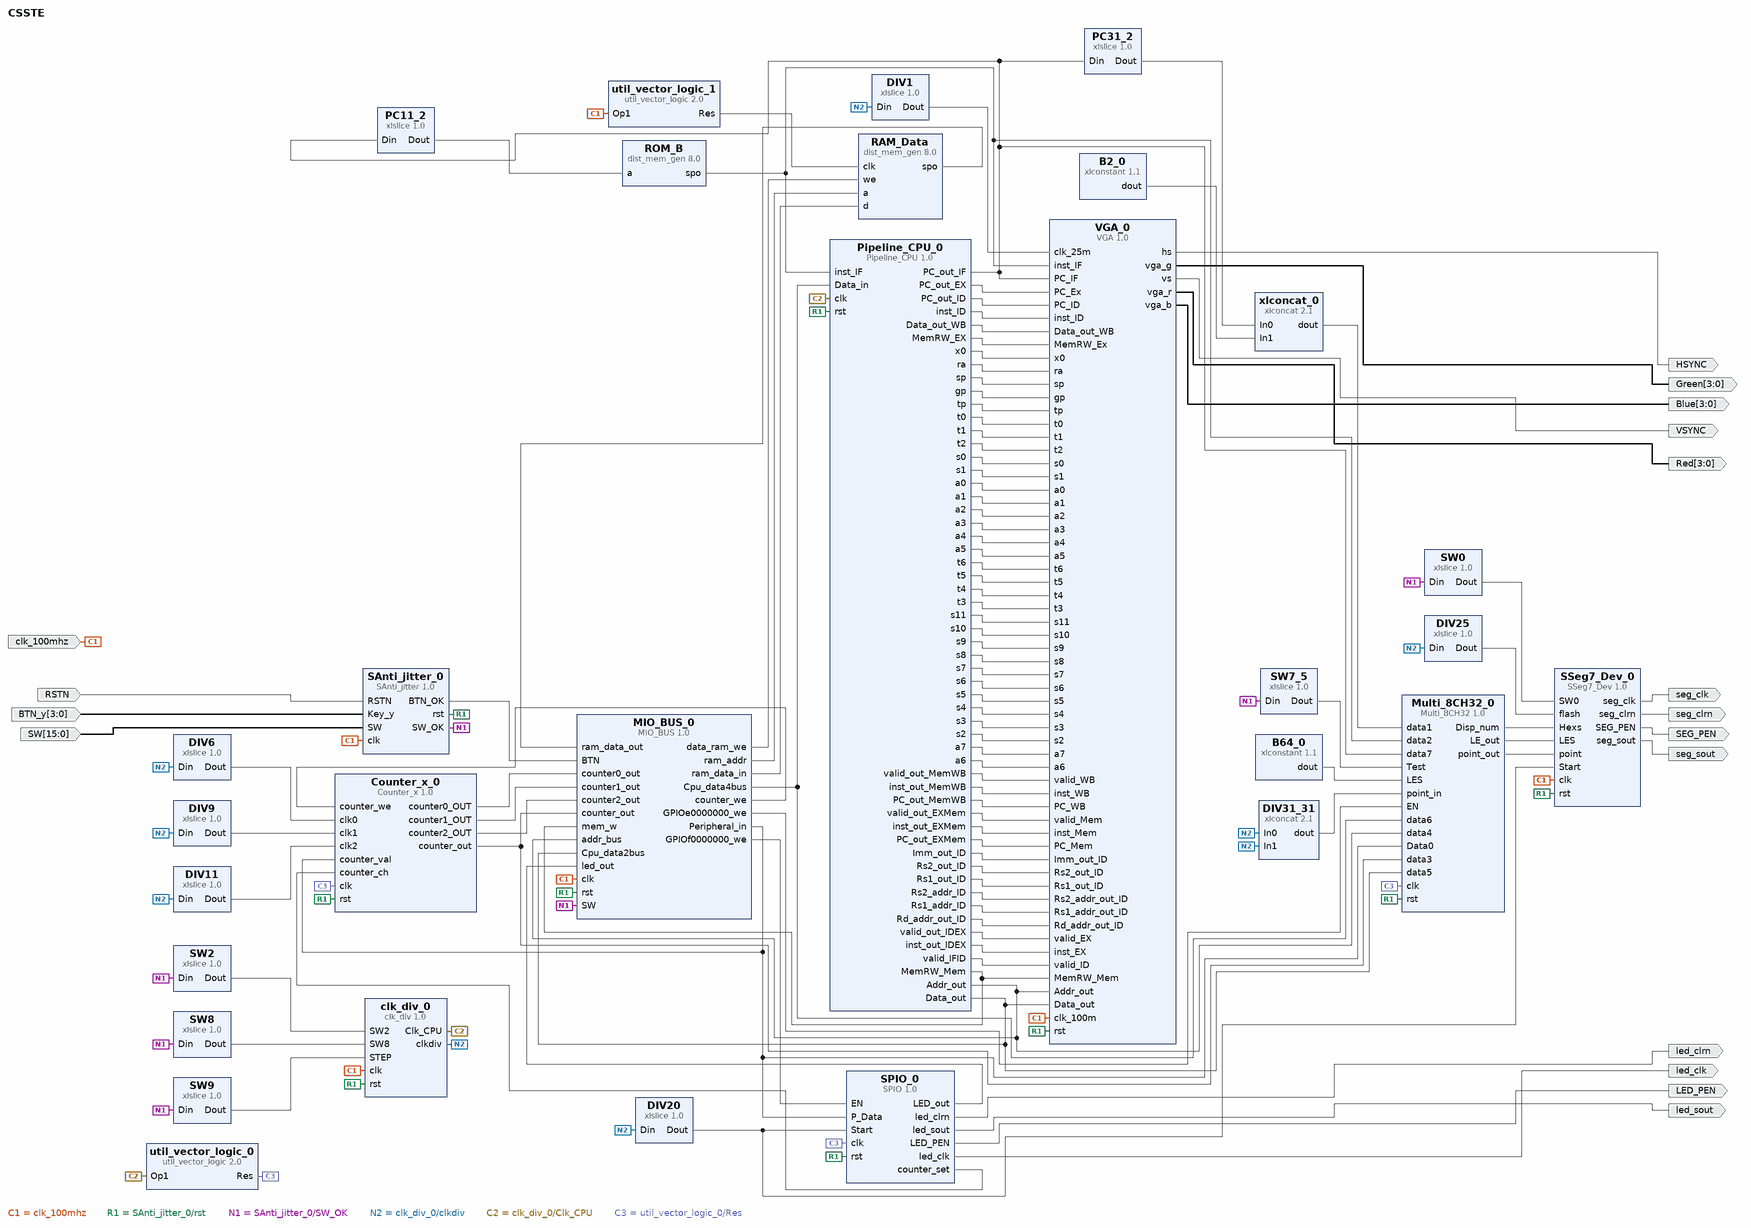
[diagram p0: block diagram of the top level]
# Vivado block design CSSTE, xc7k160tffg676-2L, Vivado 2020.2
create_bd_design CSSTE

create_bd_port -dir I -type rst RSTN
set_property -dict {CONFIG.POLARITY ACTIVE_HIGH} [get_bd_ports RSTN]
create_bd_port -dir I -type clk clk_100mhz
create_bd_port -dir I -from 3 -to 0 BTN_y
create_bd_port -dir I -from 15 -to 0 SW
create_bd_port -dir O -type clk seg_clk
create_bd_port -dir O seg_clrn
create_bd_port -dir O SEG_PEN
create_bd_port -dir O seg_sout
create_bd_port -dir O HSYNC
create_bd_port -dir O VSYNC
create_bd_port -dir O -from 3 -to 0 Green
create_bd_port -dir O -from 3 -to 0 Red
create_bd_port -dir O -from 3 -to 0 Blue
create_bd_port -dir O led_clrn
create_bd_port -dir O led_sout
create_bd_port -dir O LED_PEN
create_bd_port -dir O -type clk led_clk

create_bd_cell -type ip -vlnv xilinx.com:user:SAnti_jitter:1.0 SAnti_jitter_0
create_bd_cell -type ip -vlnv xilinx.com:user:clk_div:1.0 clk_div_0
create_bd_cell -type ip -vlnv xilinx.com:user:MIO_BUS:1.0 MIO_BUS_0
create_bd_cell -type ip -vlnv xilinx.com:user:Multi_8CH32:1.0 Multi_8CH32_0
create_bd_cell -type ip -vlnv xilinx.com:user:Counter_x:1.0 Counter_x_0
create_bd_cell -type ip -vlnv xilinx.com:user:SPIO:1.0 SPIO_0
create_bd_cell -type ip -vlnv xilinx.com:user:SSeg7_Dev:1.0 SSeg7_Dev_0
create_bd_cell -type ip -vlnv xilinx.com:ip:dist_mem_gen:8.0 ROM_B
set_property -dict [list \
  CONFIG.coefficient_file ../../../../../../COE_hazard/I_mem.coe \
  CONFIG.data_width 32 \
  CONFIG.depth 1024 \
  CONFIG.memory_type rom \
] [get_bd_cells ROM_B]
create_bd_cell -type ip -vlnv xilinx.com:ip:util_vector_logic:2.0 util_vector_logic_0
set_property -dict {CONFIG.C_OPERATION not CONFIG.C_SIZE 1} [get_bd_cells util_vector_logic_0]
create_bd_cell -type ip -vlnv xilinx.com:ip:util_vector_logic:2.0 util_vector_logic_1
set_property -dict {CONFIG.C_OPERATION not CONFIG.C_SIZE 1} [get_bd_cells util_vector_logic_1]
create_bd_cell -type ip -vlnv xilinx.com:ip:xlconcat:2.1 xlconcat_0
set_property -dict {CONFIG.IN0_WIDTH 30 CONFIG.IN1_WIDTH 2 CONFIG.dout_width 32} [get_bd_cells xlconcat_0]
create_bd_cell -type ip -vlnv xilinx.com:ip:xlconcat:2.1 DIV31_31
set_property -dict {CONFIG.IN0_WIDTH 32 CONFIG.IN1_WIDTH 32 CONFIG.dout_width 64} [get_bd_cells DIV31_31]
create_bd_cell -type ip -vlnv xilinx.com:ip:xlconstant:1.1 B64_0
set_property -dict {CONFIG.CONST_VAL 0 CONFIG.CONST_WIDTH 64} [get_bd_cells B64_0]
create_bd_cell -type ip -vlnv xilinx.com:ip:xlconstant:1.1 B2_0
set_property -dict {CONFIG.CONST_VAL 0 CONFIG.CONST_WIDTH 2} [get_bd_cells B2_0]
create_bd_cell -type ip -vlnv xilinx.com:ip:xlslice:1.0 SW7_5
set_property -dict {CONFIG.DIN_FROM 7 CONFIG.DIN_TO 5 CONFIG.DIN_WIDTH 16 CONFIG.DOUT_WIDTH 3} [get_bd_cells SW7_5]
create_bd_cell -type ip -vlnv xilinx.com:ip:xlslice:1.0 SW8
set_property -dict {CONFIG.DIN_FROM 8 CONFIG.DIN_TO 8 CONFIG.DIN_WIDTH 16 CONFIG.DOUT_WIDTH 1} [get_bd_cells SW8]
create_bd_cell -type ip -vlnv xilinx.com:ip:xlslice:1.0 DIV1
set_property -dict {CONFIG.DIN_FROM 1 CONFIG.DIN_TO 1} [get_bd_cells DIV1]
create_bd_cell -type ip -vlnv xilinx.com:ip:xlslice:1.0 PC11_2
set_property -dict {CONFIG.DIN_FROM 11 CONFIG.DIN_TO 2 CONFIG.DOUT_WIDTH 10} [get_bd_cells PC11_2]
create_bd_cell -type ip -vlnv xilinx.com:ip:xlslice:1.0 PC31_2
set_property -dict {CONFIG.DIN_FROM 31 CONFIG.DIN_TO 2 CONFIG.DOUT_WIDTH 30} [get_bd_cells PC31_2]
create_bd_cell -type ip -vlnv xilinx.com:ip:xlslice:1.0 SW2
set_property -dict {CONFIG.DIN_FROM 2 CONFIG.DIN_TO 2 CONFIG.DIN_WIDTH 16 CONFIG.DOUT_WIDTH 1} [get_bd_cells SW2]
create_bd_cell -type ip -vlnv xilinx.com:ip:xlslice:1.0 SW0
set_property -dict {CONFIG.DIN_FROM 0 CONFIG.DIN_TO 0 CONFIG.DIN_WIDTH 16} [get_bd_cells SW0]
create_bd_cell -type ip -vlnv xilinx.com:ip:xlslice:1.0 DIV6
set_property -dict {CONFIG.DIN_FROM 6 CONFIG.DIN_TO 6 CONFIG.DOUT_WIDTH 1} [get_bd_cells DIV6]
create_bd_cell -type ip -vlnv xilinx.com:ip:xlslice:1.0 DIV20
set_property -dict {CONFIG.DIN_FROM 20 CONFIG.DIN_TO 20 CONFIG.DOUT_WIDTH 1} [get_bd_cells DIV20]
create_bd_cell -type ip -vlnv xilinx.com:ip:xlslice:1.0 DIV11
set_property -dict {CONFIG.DIN_FROM 11 CONFIG.DIN_TO 11 CONFIG.DOUT_WIDTH 1} [get_bd_cells DIV11]
create_bd_cell -type ip -vlnv xilinx.com:ip:xlslice:1.0 DIV9
set_property -dict {CONFIG.DIN_FROM 9 CONFIG.DIN_TO 9 CONFIG.DOUT_WIDTH 1} [get_bd_cells DIV9]
create_bd_cell -type ip -vlnv xilinx.com:ip:xlslice:1.0 DIV25
set_property -dict {CONFIG.DIN_FROM 25 CONFIG.DIN_TO 25 CONFIG.DOUT_WIDTH 1} [get_bd_cells DIV25]
create_bd_cell -type ip -vlnv xilinx.com:ip:dist_mem_gen:8.0 RAM_Data
set_property -dict [list \
  CONFIG.coefficient_file ../../../../../../COE/D_mem.coe \
  CONFIG.data_width 32 \
  CONFIG.depth 1024 \
] [get_bd_cells RAM_Data]
create_bd_cell -type ip -vlnv xilinx.com:user:VGA:1.0 VGA_0
create_bd_cell -type ip -vlnv xilinx.com:ip:xlslice:1.0 SW9
set_property -dict {CONFIG.DIN_FROM 9 CONFIG.DIN_TO 9 CONFIG.DIN_WIDTH 16 CONFIG.DOUT_WIDTH 1} [get_bd_cells SW9]
create_bd_cell -type ip -vlnv xilinx.com:user:Pipeline_CPU:1.0 Pipeline_CPU_0

# ---- connections ----

connect_bd_net -net RSTN_0_1 [get_bd_ports RSTN] [get_bd_pins SAnti_jitter_0/RSTN]
connect_bd_net -net clk_0_1 [get_bd_ports clk_100mhz] \
  [get_bd_pins SAnti_jitter_0/clk] [get_bd_pins SSeg7_Dev_0/clk] [get_bd_pins MIO_BUS_0/clk] [get_bd_pins clk_div_0/clk] \
  [get_bd_pins util_vector_logic_1/Op1] [get_bd_pins VGA_0/clk_100m]
connect_bd_net -net Key_y_0_1 [get_bd_ports BTN_y] [get_bd_pins SAnti_jitter_0/Key_y]
connect_bd_net -net SW_0_1 [get_bd_ports SW] [get_bd_pins SAnti_jitter_0/SW]
connect_bd_net [get_bd_pins SAnti_jitter_0/rst] \
  [get_bd_pins clk_div_0/rst] [get_bd_pins Counter_x_0/rst] [get_bd_pins MIO_BUS_0/rst] [get_bd_pins SPIO_0/rst] \
  [get_bd_pins SSeg7_Dev_0/rst] [get_bd_pins Multi_8CH32_0/rst] [get_bd_pins VGA_0/rst] [get_bd_pins Pipeline_CPU_0/rst]
connect_bd_net [get_bd_pins SSeg7_Dev_0/seg_clk] [get_bd_ports seg_clk]
connect_bd_net [get_bd_pins SSeg7_Dev_0/seg_clrn] [get_bd_ports seg_clrn]
connect_bd_net [get_bd_pins SSeg7_Dev_0/SEG_PEN] [get_bd_ports SEG_PEN]
connect_bd_net [get_bd_pins SSeg7_Dev_0/seg_sout] [get_bd_ports seg_sout]
connect_bd_net [get_bd_pins VGA_0/hs] [get_bd_ports HSYNC]
connect_bd_net [get_bd_pins VGA_0/vs] [get_bd_ports VSYNC]
connect_bd_net [get_bd_pins VGA_0/vga_g] [get_bd_ports Green]
connect_bd_net [get_bd_pins VGA_0/vga_r] [get_bd_ports Red]
connect_bd_net [get_bd_pins VGA_0/vga_b] [get_bd_ports Blue]
connect_bd_net [get_bd_pins SPIO_0/led_clrn] [get_bd_ports led_clrn]
connect_bd_net [get_bd_pins SPIO_0/led_sout] [get_bd_ports led_sout]
connect_bd_net [get_bd_pins SPIO_0/LED_PEN] [get_bd_ports LED_PEN]
connect_bd_net [get_bd_pins SPIO_0/led_clk] [get_bd_ports led_clk]
connect_bd_net [get_bd_pins SPIO_0/counter_set] [get_bd_pins Counter_x_0/counter_ch]
connect_bd_net [get_bd_pins SPIO_0/LED_out] [get_bd_pins MIO_BUS_0/led_out]
connect_bd_net [get_bd_pins MIO_BUS_0/GPIOe0000000_we] [get_bd_pins Multi_8CH32_0/EN]
connect_bd_net [get_bd_pins MIO_BUS_0/GPIOf0000000_we] [get_bd_pins SPIO_0/EN]
connect_bd_net [get_bd_pins MIO_BUS_0/counter_we] [get_bd_pins Counter_x_0/counter_we]
connect_bd_net [get_bd_pins MIO_BUS_0/data_ram_we] [get_bd_pins RAM_Data/we]
connect_bd_net [get_bd_pins MIO_BUS_0/Cpu_data4bus] [get_bd_pins Multi_8CH32_0/data6] [get_bd_pins Pipeline_CPU_0/Data_in]
connect_bd_net [get_bd_pins MIO_BUS_0/Peripheral_in] \
  [get_bd_pins Multi_8CH32_0/Data0] [get_bd_pins SPIO_0/P_Data] [get_bd_pins Counter_x_0/counter_val]
connect_bd_net [get_bd_pins MIO_BUS_0/ram_addr] [get_bd_pins RAM_Data/a]
connect_bd_net [get_bd_pins MIO_BUS_0/ram_data_in] [get_bd_pins RAM_Data/d]
connect_bd_net [get_bd_pins Counter_x_0/counter_out] [get_bd_pins MIO_BUS_0/counter_out] [get_bd_pins Multi_8CH32_0/data3]
connect_bd_net -net dist_mem_gen_0_spo [get_bd_pins ROM_B/spo] \
  [get_bd_pins Multi_8CH32_0/data2] [get_bd_pins VGA_0/inst_IF] [get_bd_pins Pipeline_CPU_0/inst_IF]
connect_bd_net [get_bd_pins xlconcat_0/dout] [get_bd_pins Multi_8CH32_0/data1]
connect_bd_net [get_bd_pins Multi_8CH32_0/Disp_num] [get_bd_pins SSeg7_Dev_0/Hexs]
connect_bd_net [get_bd_pins Multi_8CH32_0/LE_out] [get_bd_pins SSeg7_Dev_0/LES]
connect_bd_net [get_bd_pins Multi_8CH32_0/point_out] [get_bd_pins SSeg7_Dev_0/point]
connect_bd_net [get_bd_pins Counter_x_0/counter0_OUT] [get_bd_pins MIO_BUS_0/counter0_out]
connect_bd_net [get_bd_pins Counter_x_0/counter1_OUT] [get_bd_pins MIO_BUS_0/counter1_out]
connect_bd_net [get_bd_pins Counter_x_0/counter2_OUT] [get_bd_pins MIO_BUS_0/counter2_out]
connect_bd_net [get_bd_pins SAnti_jitter_0/BTN_OK] [get_bd_pins MIO_BUS_0/BTN]
connect_bd_net [get_bd_pins SAnti_jitter_0/SW_OK] \
  [get_bd_pins MIO_BUS_0/SW] [get_bd_pins SW7_5/Din] [get_bd_pins SW8/Din] [get_bd_pins SW2/Din] [get_bd_pins SW0/Din] \
  [get_bd_pins SW9/Din]
connect_bd_net [get_bd_pins SW2/Dout] [get_bd_pins clk_div_0/SW2]
connect_bd_net [get_bd_pins SW8/Dout] [get_bd_pins clk_div_0/SW8]
connect_bd_net [get_bd_pins SW0/Dout] [get_bd_pins SSeg7_Dev_0/SW0]
connect_bd_net [get_bd_pins SW7_5/Dout] [get_bd_pins Multi_8CH32_0/Test]
connect_bd_net [get_bd_pins B64_0/dout] [get_bd_pins Multi_8CH32_0/LES]
connect_bd_net -net DIV_31_31 [get_bd_pins clk_div_0/clkdiv] \
  [get_bd_pins DIV31_31/In0] [get_bd_pins DIV31_31/In1] [get_bd_pins DIV1/Din] [get_bd_pins DIV6/Din] [get_bd_pins DIV20/Din] \
  [get_bd_pins DIV11/Din] [get_bd_pins DIV9/Din] [get_bd_pins DIV25/Din]
connect_bd_net [get_bd_pins DIV6/Dout] [get_bd_pins Counter_x_0/clk0]
connect_bd_net [get_bd_pins DIV9/Dout] [get_bd_pins Counter_x_0/clk1]
connect_bd_net [get_bd_pins DIV11/Dout] [get_bd_pins Counter_x_0/clk2]
connect_bd_net [get_bd_pins DIV31_31/dout] [get_bd_pins Multi_8CH32_0/point_in]
connect_bd_net [get_bd_pins DIV20/Dout] [get_bd_pins SSeg7_Dev_0/Start] [get_bd_pins SPIO_0/Start]
connect_bd_net [get_bd_pins DIV1/Dout] [get_bd_pins VGA_0/clk_25m]
connect_bd_net [get_bd_pins DIV25/Dout] [get_bd_pins SSeg7_Dev_0/flash]
connect_bd_net [get_bd_pins util_vector_logic_1/Res] [get_bd_pins RAM_Data/clk]
connect_bd_net [get_bd_pins clk_div_0/Clk_CPU] [get_bd_pins util_vector_logic_0/Op1] [get_bd_pins Pipeline_CPU_0/clk]
connect_bd_net [get_bd_pins util_vector_logic_0/Res] [get_bd_pins Counter_x_0/clk] [get_bd_pins Multi_8CH32_0/clk] [get_bd_pins SPIO_0/clk]
connect_bd_net [get_bd_pins PC31_2/Dout] [get_bd_pins xlconcat_0/In0]
connect_bd_net [get_bd_pins PC11_2/Dout] [get_bd_pins ROM_B/a]
connect_bd_net [get_bd_pins B2_0/dout] [get_bd_pins xlconcat_0/In1]
connect_bd_net [get_bd_pins Pipeline_CPU_0/PC_out_IF] \
  [get_bd_pins Multi_8CH32_0/data7] [get_bd_pins PC11_2/Din] [get_bd_pins PC31_2/Din] [get_bd_pins VGA_0/PC_IF]
connect_bd_net [get_bd_pins Pipeline_CPU_0/PC_out_EX] [get_bd_pins VGA_0/PC_Ex]
connect_bd_net [get_bd_pins Pipeline_CPU_0/PC_out_ID] [get_bd_pins VGA_0/PC_ID]
connect_bd_net [get_bd_pins Pipeline_CPU_0/inst_ID] [get_bd_pins VGA_0/inst_ID]
connect_bd_net [get_bd_pins Pipeline_CPU_0/Addr_out] [get_bd_pins Multi_8CH32_0/data4] [get_bd_pins MIO_BUS_0/addr_bus] [get_bd_pins VGA_0/Addr_out]
connect_bd_net [get_bd_pins Pipeline_CPU_0/Data_out_WB] [get_bd_pins VGA_0/Data_out_WB]
connect_bd_net [get_bd_pins Pipeline_CPU_0/Data_out] \
  [get_bd_pins MIO_BUS_0/Cpu_data2bus] [get_bd_pins Multi_8CH32_0/data5] [get_bd_pins VGA_0/Data_out]
connect_bd_net [get_bd_pins Pipeline_CPU_0/MemRW_Mem] [get_bd_pins MIO_BUS_0/mem_w] [get_bd_pins VGA_0/MemRW_Mem]
connect_bd_net [get_bd_pins Pipeline_CPU_0/MemRW_EX] [get_bd_pins VGA_0/MemRW_Ex]
connect_bd_net [get_bd_pins RAM_Data/spo] [get_bd_pins MIO_BUS_0/ram_data_out]
connect_bd_net [get_bd_pins Pipeline_CPU_0/x0] [get_bd_pins VGA_0/x0]
connect_bd_net [get_bd_pins Pipeline_CPU_0/ra] [get_bd_pins VGA_0/ra]
connect_bd_net [get_bd_pins Pipeline_CPU_0/sp] [get_bd_pins VGA_0/sp]
connect_bd_net [get_bd_pins Pipeline_CPU_0/gp] [get_bd_pins VGA_0/gp]
connect_bd_net [get_bd_pins Pipeline_CPU_0/tp] [get_bd_pins VGA_0/tp]
connect_bd_net [get_bd_pins Pipeline_CPU_0/t0] [get_bd_pins VGA_0/t0]
connect_bd_net [get_bd_pins Pipeline_CPU_0/t1] [get_bd_pins VGA_0/t1]
connect_bd_net [get_bd_pins Pipeline_CPU_0/t2] [get_bd_pins VGA_0/t2]
connect_bd_net [get_bd_pins Pipeline_CPU_0/s0] [get_bd_pins VGA_0/s0]
connect_bd_net [get_bd_pins Pipeline_CPU_0/s1] [get_bd_pins VGA_0/s1]
connect_bd_net [get_bd_pins Pipeline_CPU_0/a0] [get_bd_pins VGA_0/a0]
connect_bd_net [get_bd_pins Pipeline_CPU_0/a1] [get_bd_pins VGA_0/a1]
connect_bd_net [get_bd_pins Pipeline_CPU_0/a2] [get_bd_pins VGA_0/a2]
connect_bd_net [get_bd_pins Pipeline_CPU_0/a3] [get_bd_pins VGA_0/a3]
connect_bd_net [get_bd_pins Pipeline_CPU_0/a4] [get_bd_pins VGA_0/a4]
connect_bd_net [get_bd_pins Pipeline_CPU_0/a5] [get_bd_pins VGA_0/a5]
connect_bd_net [get_bd_pins Pipeline_CPU_0/t6] [get_bd_pins VGA_0/t6]
connect_bd_net [get_bd_pins Pipeline_CPU_0/t5] [get_bd_pins VGA_0/t5]
connect_bd_net [get_bd_pins Pipeline_CPU_0/t4] [get_bd_pins VGA_0/t4]
connect_bd_net [get_bd_pins Pipeline_CPU_0/t3] [get_bd_pins VGA_0/t3]
connect_bd_net [get_bd_pins Pipeline_CPU_0/s11] [get_bd_pins VGA_0/s11]
connect_bd_net [get_bd_pins Pipeline_CPU_0/s10] [get_bd_pins VGA_0/s10]
connect_bd_net [get_bd_pins Pipeline_CPU_0/s9] [get_bd_pins VGA_0/s9]
connect_bd_net [get_bd_pins Pipeline_CPU_0/s8] [get_bd_pins VGA_0/s8]
connect_bd_net [get_bd_pins Pipeline_CPU_0/s7] [get_bd_pins VGA_0/s7]
connect_bd_net [get_bd_pins Pipeline_CPU_0/s6] [get_bd_pins VGA_0/s6]
connect_bd_net [get_bd_pins Pipeline_CPU_0/s5] [get_bd_pins VGA_0/s5]
connect_bd_net [get_bd_pins Pipeline_CPU_0/s4] [get_bd_pins VGA_0/s4]
connect_bd_net [get_bd_pins Pipeline_CPU_0/s3] [get_bd_pins VGA_0/s3]
connect_bd_net [get_bd_pins Pipeline_CPU_0/s2] [get_bd_pins VGA_0/s2]
connect_bd_net [get_bd_pins Pipeline_CPU_0/a7] [get_bd_pins VGA_0/a7]
connect_bd_net [get_bd_pins Pipeline_CPU_0/a6] [get_bd_pins VGA_0/a6]
connect_bd_net [get_bd_pins Pipeline_CPU_0/valid_out_MemWB] [get_bd_pins VGA_0/valid_WB]
connect_bd_net [get_bd_pins Pipeline_CPU_0/inst_out_MemWB] [get_bd_pins VGA_0/inst_WB]
connect_bd_net [get_bd_pins Pipeline_CPU_0/PC_out_MemWB] [get_bd_pins VGA_0/PC_WB]
connect_bd_net [get_bd_pins Pipeline_CPU_0/valid_out_EXMem] [get_bd_pins VGA_0/valid_Mem]
connect_bd_net [get_bd_pins Pipeline_CPU_0/inst_out_EXMem] [get_bd_pins VGA_0/inst_Mem]
connect_bd_net [get_bd_pins Pipeline_CPU_0/PC_out_EXMem] [get_bd_pins VGA_0/PC_Mem]
connect_bd_net [get_bd_pins Pipeline_CPU_0/Imm_out_ID] [get_bd_pins VGA_0/Imm_out_ID]
connect_bd_net [get_bd_pins Pipeline_CPU_0/Rs2_out_ID] [get_bd_pins VGA_0/Rs2_out_ID]
connect_bd_net [get_bd_pins Pipeline_CPU_0/Rs1_out_ID] [get_bd_pins VGA_0/Rs1_out_ID]
connect_bd_net [get_bd_pins Pipeline_CPU_0/Rs2_addr_ID] [get_bd_pins VGA_0/Rs2_addr_out_ID]
connect_bd_net [get_bd_pins Pipeline_CPU_0/Rs1_addr_ID] [get_bd_pins VGA_0/Rs1_addr_out_ID]
connect_bd_net [get_bd_pins Pipeline_CPU_0/Rd_addr_out_ID] [get_bd_pins VGA_0/Rd_addr_out_ID]
connect_bd_net [get_bd_pins Pipeline_CPU_0/valid_out_IDEX] [get_bd_pins VGA_0/valid_EX]
connect_bd_net [get_bd_pins Pipeline_CPU_0/inst_out_IDEX] [get_bd_pins VGA_0/inst_EX]
connect_bd_net [get_bd_pins Pipeline_CPU_0/valid_IFID] [get_bd_pins VGA_0/valid_ID]
connect_bd_net [get_bd_pins SW9/Dout] [get_bd_pins clk_div_0/STEP]

validate_bd_design
save_bd_design
